# EAGLE design SOT23_SOT323_Vert (EAGLE 9.6.2)
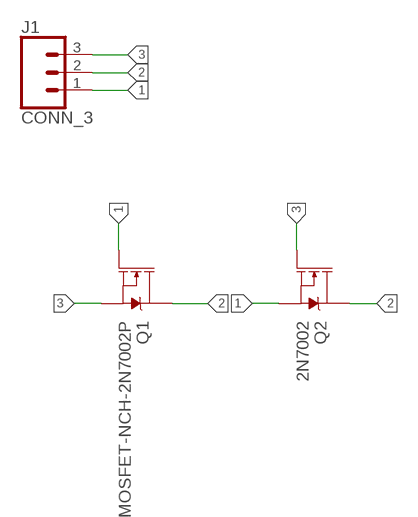
[diagram p0: schematic, sheet 1]

## Parts
J1  CONN_3  [1X03]
Q1  MOSFET-NCH-2N7002P  [SOT23-3]
Q2  2N7002  MOSFET-NCH-2N7002PW  [SOT323]

## Nets
1: J1.1 Q1.1(G) Q2.2(S)
2: J1.2 Q1.3(D) Q2.3(D)
3: J1.3 Q1.2(S) Q2.1(G)

## Library data of the parts
J1 = bschulz:CONN_3: Genaric 3 terminal header Digikey 2.54_SCREW <https://www.digikey.com/product-detail/en/on-shore-technology-inc/OSTVN03A150/ED10562-ND/1588863> 3.5_SCREW <https://www.digikey.com/product-detail/en/on-shore-technology-inc/OSTTE030161/ED2636-ND/614585>
Q1 = bschulz:MOSFET-NCH: N-channel MOSFETs Voltage controlled devices that allow control of high current outputs. SparkFun Products: SparkFun OpenScale <https://www.sparkfun.com/products/13261> SparkFun Digital Sandbox <https://www.sparkfun.com/products/12651> SparkFun Monster Moto Shield <https://www.sparkfun.com/products/10182> SparkFun MOSFET Power Controller <https://www.sparkfun.com/products/11214>; DIGIKEY: 1727-4692-1-ND; MF: Nexperia; MPN: 2N7002P,215
Q2 = bschulz:MOSFET-NCH: N-channel MOSFETs Voltage controlled devices that allow control of high current outputs. SparkFun Products: SparkFun OpenScale <https://www.sparkfun.com/products/13261> SparkFun Digital Sandbox <https://www.sparkfun.com/products/12651> SparkFun Monster Moto Shield <https://www.sparkfun.com/products/10182> SparkFun MOSFET Power Controller <https://www.sparkfun.com/products/11214>; DIGIKEY: 2N7002W-FDICT-ND; MF: Diodes Incorporated; MPN: 2N7002W-7-F; PROD_ID: TRANS-11151

## Board
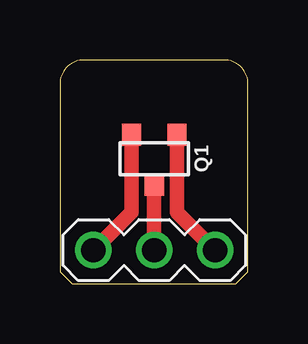
[diagram p1: board, top side]
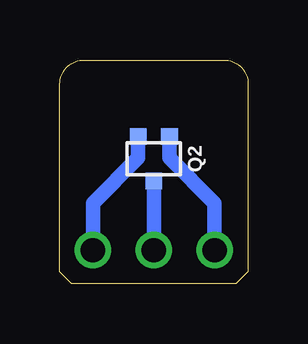
[diagram p2: board, bottom side, seen from below]

Size 7.85 x 9.32 mm. Coordinates in mm from the lower left corner, seen from the top.
Outline: 6.85,9.32 1,9.32 arc90 0,8.32 0,0.5 0.5,0 7.35,0 7.85,0.5 7.85,8.32 arc90 6.85,9.32
Copper layers (1*16): Top 0.035559375mm / dielectric 1.6mm / Bottom 0.035559375mm
Design rules "oshpark-2layer": minimum track width 6mil, minimum drill 10mil, track to track 6mil, track to pad 6mil, pad to pad 6mil, via to via 6mil, smd to smd 6mil, copper to edge 15mil, drill to drill 6mil, minimum pad ring 5mil, minimum via ring 5mil, stop-mask expansion 2.5mil, vias tented up to drill 0mil, thermal gap 10mil

### Footprints (pad centres in the part's own frame; a part is rotated, then mirrored left to right if it is on the bottom)
1X03 = drill 1.016: 1 -2.54,0; 2 0,0; 3 2.54,0
SOT23-3 = smd 0.8 x 0.9: 1 -0.95,-1; 2 0.95,-1; 3 0,1.1
SOT323 = smd 0.7 x 0.7: 1 -0.65,-0.925; 2 0.65,-0.925; 3 0,0.925

### Placement (x,y rotation side)
J1  3.94,1.4 180 top
Q1  3.94,5.21 180 top
Q2  3.94,5.21 180 bottom

### Tracks (layer width: path | path; a pad name or v marks a point on that pad's centre or on a via)
1
  Top 0.61: Q1.1 4.89,2.99 J1.1
  Bottom 0.61: Q2.2 4.59,5.24 6.48,3.35 J1.1
2
  Top 0.61: Q1.3 J1.2
  Bottom 0.61: Q2.3 J1.2
3
  Top 0.61: Q1.2 2.99,2.99 J1.3
  Bottom 0.61: Q2.1 3.29,5.24 1.4,3.35 J1.3

### Text on the board
tDocu: SOT23 | B. Schulz
bDocu: SOT323 | Break44